# Altium project ApolloEcho_Dev_Kit.PrjPcb
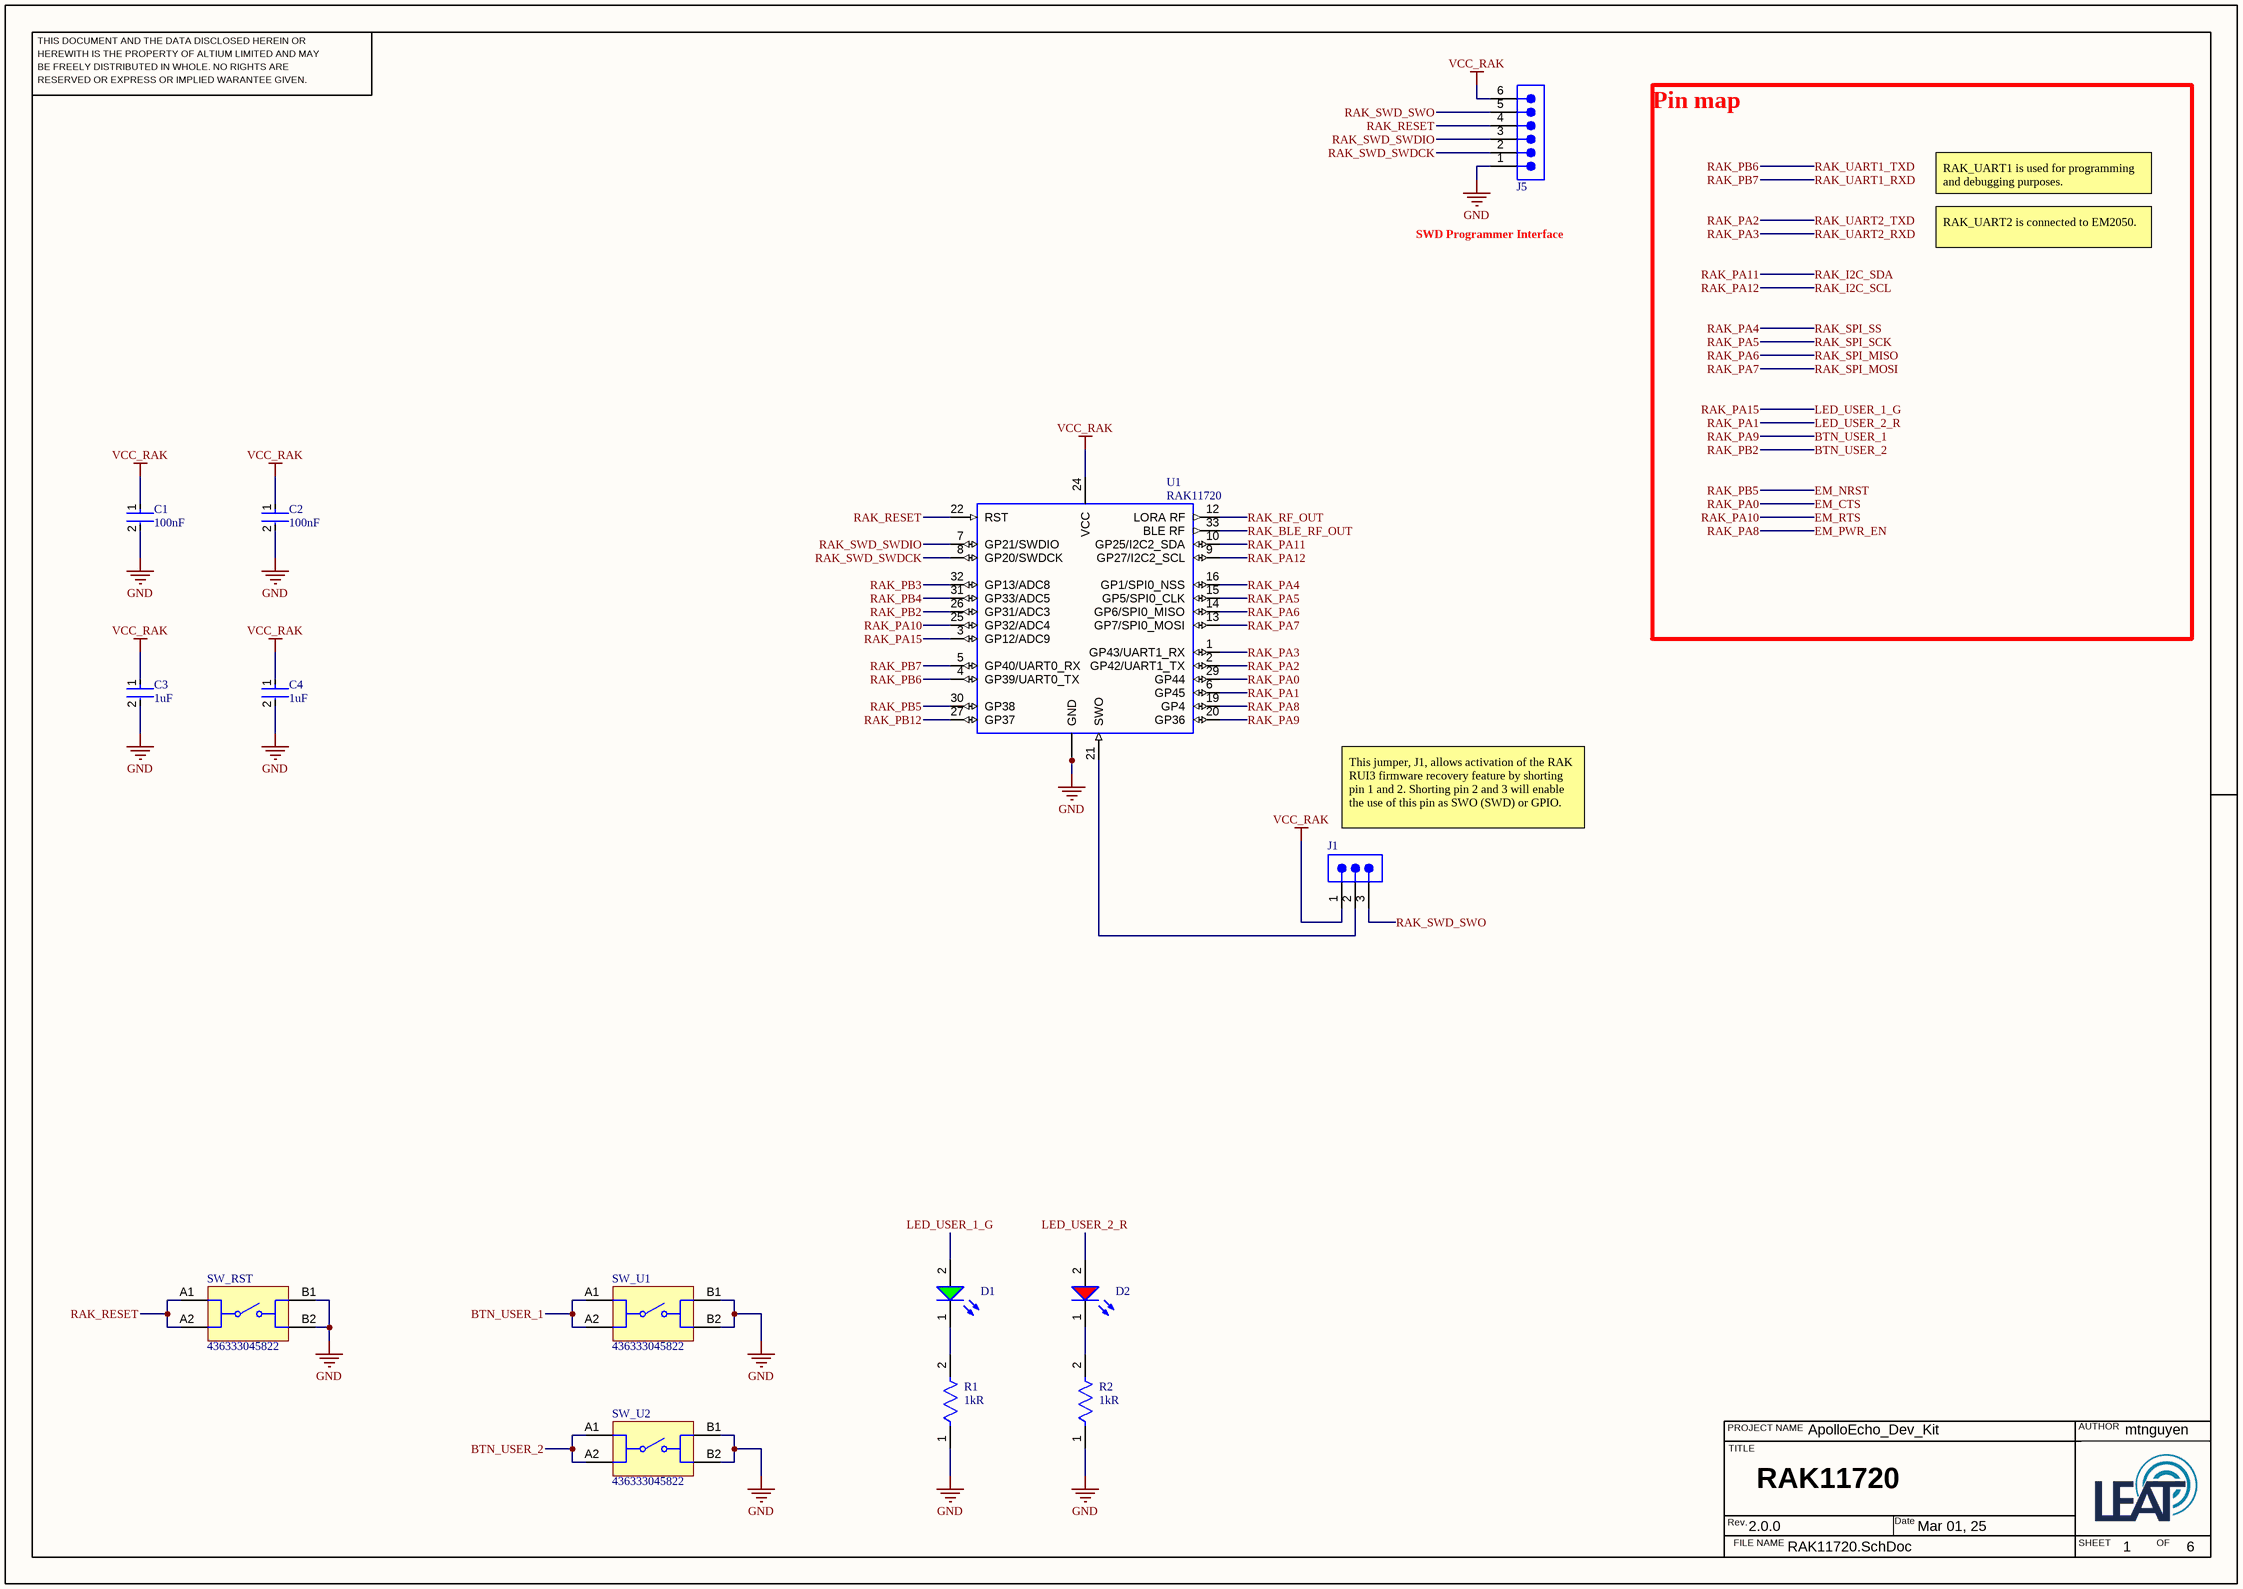
[diagram p0: RAK11720.SchDoc]
6 sheets, 74 parts. Net scope: global (net labels, ports and power ports of the same name join across sheets).
Board file: ApolloEcho_Dev_Kit.PcbDoc
Sheets:
  RAK11720.SchDoc
  EM2050.SchDoc
  USB_Serial.SchDoc
  Power.SchDoc
  RF.SchDoc
  IOs.SchDoc

## Sheet RAK11720.SchDoc
size 420 x 297 mm; ENG_APP_DATE: --/--/--; DSN_APP_DATE: --/--/--; CHK_APP_DATE: --/--/--; Date: TEST; SheetNumber: 1; SheetTotal: 6; Sheet_Text_ProjectName: ApolloEcho_Dev_Kit; Sheet_Text_Author: mtnguyen; Sheet_Text_Title: RAK11720; Sheet_Text_Rev: 2.0.0; Sheet_Text_Date: Mar 01, 25; SPICEModelCacheMDNMBSZG: <root> / <DocumentId>MDNMBSZG</DocumentId> / <CacheFrame Number="0"> / <Model Name="emk105bj105_v-f" Kind="CKT"> / <Text>* EMK105BJ105_V-F     SPICE MODEL  ( General Type ) / *-------------------------------------------------------------------------------------------------------- / * Model Generated by TAIYO YUDEN Corporation (http://www.ty-top.com) / * Version 1.0 / * TAIYO YUDEN Control No. 170508_130520 / * Copyright(c) 2012 TAIYO YUDEN CO.,LTD. All Rights Reserved. / *-------------------------------------------------------------------------------------------------------- / * / * Products Name : Multilayer Ceramic Capacitors / * / * Characteristics : / *     Capacitance : 1 uF , Rated Voltage : 16V , TCC : X5R / *     Case Size : 1.0 x 0.5 / 0.039 x 0.02 [mm/inch] , Thickness : 0.5 / 0.02 [mm/inch] / *     (Conditions: Temperature = 25 degC , DC Bias Current/Voltage = 0A / 0V) / * / * Frequency Range : 40Hz - 3GHz / * / * External Node Assignments : / * / *  1  o---| |---o  2 / * / *-------------------------------------------------------------------------------------------------------- / .SubCkt EMK105BJ105_V-F 1 2 / **************************** / C0 1 110 0.68309u / Cm 1 101 0.26053u / C1 101 102 0.94076u / Rc1 101 102 1.9029k / C2 102 103 0.66707u / Rc2 102 103 120.36 / C3 103 110 0.57203u / Rc3 103 110 2.1097 / C2m 1 301 0.1871u / C21 301 302 3.2494u / Rc21 301 302 1.1117k / C22 302 303 2.1014u / Rc22 302 303 1.484k / C23 303 304 2.1172u / Rc23 303 304 1.3876k / C24 304 305 0.75729u / Rc24 304 305 332.59 / C25 305 306 0.94401u / Rc25 305 306 249.09 / C26 306 307 0.34674u / Rc26 306 307 28.352 / C27 307 308 0.37158u / Rc27 307 308 19.989 / C28 308 309 0.17933u / Rc28 308 309 31.748 / C29 309 110 0.016445u / Rc29 309 110 1.0592 / Rp0 1 110 100Meg / L0 110 120 0.2216n / Lm 120 130 0.1509n / L1 120 121 0.12659n / RL1 121 130 0.85161 / L2 120 122 0.15996n / RL2 122 130 0.42469 / L3 120 123 7.9543n / RL3 123 130 0.54643m / CR 120 124 0.24334u / LR 124 125 0.090738n / RR 125 130 68.076m / CL 130 140 2.7354p / LL 130 140 0.10762n / RL 130 140 50.614 / Rs 140 2 7.5416m / **************************** / .ends EMK105BJ105_V-F</Text> / </Model> / </CacheFrame> / </root>

### Parts
C1  Capacitance: 100nF  [FP-0402-L_1_0_1-W_0_5_0_1-IPC_C]  (hidden comment: 0402ZD104KAT2A)
C2  Capacitance: 100nF  [FP-0402-L_1_0_1-W_0_5_0_1-IPC_C]  (hidden comment: 0402ZD104KAT2A)
C3  Capacitance: 1uF  [FP-0402-L_1_0_0_05-W_0_5-IPC_A]  (hidden comment: EMK105BJ105KV-F)
C4  Capacitance: 1uF  [FP-0402-L_1_0_0_05-W_0_5-IPC_A]  (hidden comment: EMK105BJ105KV-F)
D1  150060VS75000  [WL-SMCW_0603_150060xx75000]  (value not drawn)
D2  150060RS75000  [WL-SMCW_0603_150060xx75000]  (value not drawn)
J1  61300311121  [61300311121]  (value not drawn)
J5  61300611121  [61300611121]  (value not drawn)
R1  Resistance: 1kR  [FP-RMCF0402-IPC_A]  (hidden comment: RMCF0402FT1K00)
R2  Resistance: 1kR  [FP-RMCF0402-IPC_A]  (hidden comment: RMCF0402FT1K00)
SW_RST  436333045822  [436333045822]
SW_U1  436333045822  [436333045822]
SW_U2  436333045822  [436333045822]
U1  RAK11720  [RAK11720]

### Nets
GND: C1.2 C2.2 C3.2 C4.2 J5.1 R1.1 R2.1 SW_RST.B1 SW_RST.B2 SW_U1.B1 SW_U1.B2 SW_U2.B1 SW_U2.B2 U1.11(GND) U1.17(GND) U1.18(GND) U1.23(GND) U1.28(GND) U1.34(GND)
VCC_RAK: C1.1 C2.1 C3.1 C4.1 J1.1 J5.6 U1.24(VCC)
BTN_USER_1: SW_U1.A1 SW_U1.A2 U1.20(GP36)  [also labelled RAK_PA9]
BTN_USER_2: SW_U2.A1 SW_U2.A2 U1.26(GP31/ADC3)  [also labelled RAK_PB2]
EM_CTS: U1.29(GP44)  [also labelled RAK_PA0]
EM_NRST: U1.30(GP38)  [also labelled RAK_PB5]
EM_PWR_EN: U1.19(GP4)  [also labelled RAK_PA8]
EM_RTS: U1.25(GP32/ADC4)  [also labelled RAK_PA10]
LED_USER_1_G: D1.2(A) U1.3(GP12/ADC9)  [also labelled RAK_PA15]
LED_USER_2_R: D2.2(A) U1.6(GP45)  [also labelled RAK_PA1]
RAK_BLE_RF_OUT: U1.33(BLE_RF)
RAK_I2C_SCL: U1.9(GP27/I2C2_SCL)  [also labelled RAK_PA12]
RAK_I2C_SDA: U1.10(GP25/I2C2_SDA)  [also labelled RAK_PA11]
RAK_PA2: U1.2(GP42/UART1_TX)  [also labelled RAK_UART2_TXD]
RAK_PA3: U1.1(GP43/UART1_RX)  [also labelled RAK_UART2_RXD]
RAK_PA4: U1.16(GP1/SPI0_NSS)  [also labelled RAK_SPI_SS]
RAK_PA5: U1.15(GP5/SPI0_CLK)  [also labelled RAK_SPI_SCK]
RAK_PA6: U1.14(GP6/SPI0_MISO)  [also labelled RAK_SPI_MISO]
RAK_PA7: U1.13(GP7/SPI0_MOSI)  [also labelled RAK_SPI_MOSI]
RAK_PB3: U1.32(GP13/ADC8)
RAK_PB4: U1.31(GP33/ADC5)
RAK_PB6: U1.4(GP39/UART0_TX)  [also labelled RAK_UART1_TXD]
RAK_PB7: U1.5(GP40/UART0_RX)  [also labelled RAK_UART1_RXD]
RAK_PB12: U1.27(GP37)
RAK_RESET: J5.4 SW_RST.A1 SW_RST.A2 U1.22(RST)
RAK_RF_OUT: U1.12(LORA_RF)
RAK_SWD_SWDCK: J5.2 U1.8(GP20/SWDCK)
RAK_SWD_SWDIO: J5.3 U1.7(GP21/SWDIO)
RAK_SWD_SWO: J1.3 J5.5
NetD1_1: D1.1(K) R1.2
NetD2_1: D2.1(K) R2.2
NetJ1_2: J1.2 U1.21(SWO)

### Notes on the sheet
- RAK_UART1 is used for programming and debugging purposes.
- SWD Programmer Interface
- RAK_UART2 is connected to EM2050.
- Pin map
- This jumper, J1, allows activation of the RAK RUI3 firmware recovery feature by shorting pin 1 and 2. Shorting pin 2 and 3 will enable the use of this pin as SWO (SWD) or GPIO.
- THIS DOCUMENT AND THE DATA DISCLOSED HEREIN OR
- HEREWITH IS THE PROPERTY OF ALTIUM LIMITED AND MAY
- BE FREELY DISTRIBUTED IN WHOLE. NO RIGHTS ARE
- RESERVED OR EXPRESS OR IMPLIED WARANTEE GIVEN.
- PROJECT NAME
- TITLE
- AUTHOR
- Rev.
- FILE NAME
- Date
- SHEET
- OF

### Library data of the parts
C1 C2 = CMP-2008-02878-3: General Purpose Ceramic Capacitor, 0402, 100nF, 10%, X5R, 15%, 10V; Dissipation Factor: 5%; Insulation Resistance: 100GR; Case/Package: 0402; Termination: SMD/SMT; Thickness: 0.022inch; Packaging: Tape and Reel; REACH SVHC: No SVHC; Case Code (Imperial): 0402; Width: 0.02inch; Series: -; Construction: Flat; Dielectric: X5R; Voltage: 10V; Height: 0.56mm; Voltage Rating (DC): 10V; Depth: 0.5mm; Tolerance: 10%; Radiation Hardening: No; Voltage Rating: 10V; Package Quantity: 1; Contact Plating: Tin; RoHS Compliant: Yes; Case Code (Metric): 1005; Lead Free: Lead Free; Max Operating Temperature: 85°C; Length: 1mm; Min Operating Temperature: -55°C; Mount: Surface Mount
C3 C4 = CMP-14477-000104-2: None; Tolerance: 10%; Voltage Rating: 16V; Dielectric: X5R; Packaging: Tape and Reel; Depth: 0.5mm; Mount: Surface Mount; Thickness: 0.022inch; Package Quantity: 1; Min Operating Temperature: -55°C; Series: M; Voltage Rating (DC): 16V; Termination: SMD/SMT; Case/Package: 0402; Number of Pins: 2; Case Code (Imperial): 0402; Length: 1mm; Halogen Free: Halogen Free; Case Code (Metric): 1005; Width: 0.02inch; RoHS Compliant: Yes; Radiation Hardening: No; Max Operating Temperature: 85°C; Height: 0.5mm; Construction: Flat
D1 = CMP-1426-00006-7: WURTH ELEKTRONIK - 150060VS75000 - LED, Green, SMD, 0603, 30 mA, 2 V, 570 nm; Reverse Voltage: 5V; Power Dissipation: 72mW; Dominant Wavelength: 570nm; Peak Wavelength: 572nm; Forward Current: 100mA; Forward Voltage: 2V; Lens Style: Clear, Rectangular; Test Current: 20mA; Max Junction Temperature (Tj): 95°C; Viewing Angle: 140°; Luminous Intensity: 40mcd; Height: 700µm; Width: 800µm; Length: 1.6mm; Mount: Surface Mount; Min Operating Temperature: -40°C; Max Reverse Voltage (DC): 5V; Case Code (Imperial): 0603; Wavelength: 570nm; Color: Green; REACH SVHC: Unknown; RoHS: Compliant; Max Operating Temperature: 85°C; Packaging: Tape and Reel; Case/Package: 0603; Number of Pins: 2; Case Code (Metric): 1608
D2 = CMP-1426-00001-4: LED Low-Power Uni-Color Red 630nm 2V 2-Pin Chip 0603(1608Metric) T/R; Max Junction Temperature (Tj): 95°C; Dominant Wavelength: 625nm; Lens Style: Clear, Rectangular; Viewing Angle: 140°; Forward Current: 100mA; Max Reverse Voltage (DC): 5V; Luminous Intensity: 250mcd; Test Current: 20mA; Power Dissipation: 72mW; Max Operating Temperature: 85°C; Mount: Surface Mount; Height: 700µm; Packaging: Tape and Reel; REACH SVHC: Unknown; Case Code (Metric): 1608; Peak Wavelength: 630nm; Forward Voltage: 2V; Case/Package: 0603; Color: Red; RoHS: Compliant; Width: 800µm; Reverse Voltage: 5V; Min Operating Temperature: -40°C; Wavelength: 625nm; Case Code (Imperial): 0603; Length: 1.6mm
J1 = CMP-1502-01062-3: NexarPartId: 32855521; Current Rating: 3A; Voltage Rating: 250V; Number of Positions: 3; Pitch: 2.54mm; Contact Resistance: 20mΩ; Connector Type: Male Pin; Gender: Male; REACH SVHC: Unknown; Packaging: Bulk; Contact Material: Copper; Min Operating Temperature: -40°C; Number of Rows: 1; Orientation: Vertical; RoHS: Compliant; Contact Plating: Gold; Max Operating Temperature: 105°C; Mount: Through Hole; Height: 8.94mm; Operating Supply Voltage: 250V; Number of Pins: 3; Contact Mating Length: 5.9944mm; Number of Contacts: 3; Color: Black; Lead Free: Lead Free; Lead Pitch: 2.54mm; Termination: Solder
J5 = CMP-1502-01070-3: NexarPartId: 20084590; Current Rating: 3A; Pitch: 2.54mm; Gender: Male; Operating Supply Voltage: 250V; Connector Type: Male Pin; Number of Positions: 6; Contact Resistance: 20mΩ; Packaging: Bulk; Number of Pins: 6; Number of Rows: 1; Contact Plating: Gold; Lead Free: Lead Free; RoHS: Compliant; Contact Mating Length: 5.9944mm; Voltage Rating: 250V; REACH SVHC: Unknown; Contact Gender: Male; Housing Material: PBT; Min Operating Temperature: -40°C; Lead Pitch: 2.54mm; Mount: Through Hole; Number of Contacts: 6; Max Operating Temperature: 105°C; Contact Material: Copper; Orientation: Vertical; Termination: Through Hole; Color: Black; Height: 8.89mm
R1 R2 = CMP-26527-000026-1: 1kΩ ±1% 0.063W 0402 Thick Film Chip Resistor AEC-Q200 compliant; Temperature Coefficient: 100ppm/°C; Power Rating: 63mW; Length: 1mm; RoHS Compliant: Yes; Construction: Rectangular; Height: 0.016inch; Size Code: 0402; Lead Free: Lead Free; Radiation Hardening: No; Tolerance: 1%; Width: 0.02inch; Military Standard: Not; Resistor Type: Thick Film; Number of Terminations: 2; Min Operating Temperature: -55°C; Max Operating Temperature: 155°C; Depth: 0.5mm; Features: Automotive AEC-Q200; Packaging: Tape and Reel; Case Code (Metric): 1005; Mount: Surface Mount; Contact Plating: Tin; Max Power Dissipation: 63mW; Case/Package: 0402; Case Code (Imperial): 0402; Series: RMCF
SW_RST SW_U1 SW_U2 = CMP-1464-00001-2: NexarPartId: 22866045; Voltage Rating: 12V; Contact Resistance: 100mΩ; Operating Force: 220N; Current Rating: 50mA; Height: 1.65mm; Contact Plating: Silver; Min Operating Temperature: -40°C; Insulation Resistance: 100MΩ; Max Operating Temperature: 85°C; RoHS: Compliant; Packaging: Tape and Reel; Width: 4.7mm; Contact Current Rating: 50mA
U1 = RAK11720: RAK11720 Ambiq Apollo3 Blue SX1262 LoRa Bluetooth Module for LoRaWAN; MP: RAK3172; MF: Shenzhen RAKwireless Technology Co.,Ltd.; Value: *; Check_prices: https://www.snapeda.com/parts/RAK3172/Shenzhen+RAKwireless+Technology+Co.%252CLtd./view-part/?ref=eda; Package: Package; Price: None; Availability: Not in stock; SnapEDA_Link: https://www.snapeda.com/parts/RAK3172/Shenzhen+RAKwireless+Technology+Co.%252CLtd./view-part/?ref=snap

## Sheet EM2050.SchDoc
size 420 x 297 mm; ENG_APP_DATE: --/--/--; DSN_APP_DATE: --/--/--; CHK_APP_DATE: --/--/--; Date: TEST; SheetNumber: 2; SheetTotal: 6; Sheet_Text_ProjectName: ApolloEcho_Dev_Kit; Sheet_Text_Author: mtnguyen; Sheet_Text_Title: EM2050; Sheet_Text_Rev: 2.0.0; Sheet_Text_Date: Mar 01, 25; SPICEModelCacheUWNOKGRN: <root> / <DocumentId>UWNOKGRN</DocumentId> / <CacheFrame Number="0"> / <Model Name="emk105bj105_v-f" Kind="CKT"> / <Text>* EMK105BJ105_V-F     SPICE MODEL  ( General Type ) / *-------------------------------------------------------------------------------------------------------- / * Model Generated by TAIYO YUDEN Corporation (http://www.ty-top.com) / * Version 1.0 / * TAIYO YUDEN Control No. 170508_130520 / * Copyright(c) 2012 TAIYO YUDEN CO.,LTD. All Rights Reserved. / *-------------------------------------------------------------------------------------------------------- / * / * Products Name : Multilayer Ceramic Capacitors / * / * Characteristics : / *     Capacitance : 1 uF , Rated Voltage : 16V , TCC : X5R / *     Case Size : 1.0 x 0.5 / 0.039 x 0.02 [mm/inch] , Thickness : 0.5 / 0.02 [mm/inch] / *     (Conditions: Temperature = 25 degC , DC Bias Current/Voltage = 0A / 0V) / * / * Frequency Range : 40Hz - 3GHz / * / * External Node Assignments : / * / *  1  o---| |---o  2 / * / *-------------------------------------------------------------------------------------------------------- / .SubCkt EMK105BJ105_V-F 1 2 / **************************** / C0 1 110 0.68309u / Cm 1 101 0.26053u / C1 101 102 0.94076u / Rc1 101 102 1.9029k / C2 102 103 0.66707u / Rc2 102 103 120.36 / C3 103 110 0.57203u / Rc3 103 110 2.1097 / C2m 1 301 0.1871u / C21 301 302 3.2494u / Rc21 301 302 1.1117k / C22 302 303 2.1014u / Rc22 302 303 1.484k / C23 303 304 2.1172u / Rc23 303 304 1.3876k / C24 304 305 0.75729u / Rc24 304 305 332.59 / C25 305 306 0.94401u / Rc25 305 306 249.09 / C26 306 307 0.34674u / Rc26 306 307 28.352 / C27 307 308 0.37158u / Rc27 307 308 19.989 / C28 308 309 0.17933u / Rc28 308 309 31.748 / C29 309 110 0.016445u / Rc29 309 110 1.0592 / Rp0 1 110 100Meg / L0 110 120 0.2216n / Lm 120 130 0.1509n / L1 120 121 0.12659n / RL1 121 130 0.85161 / L2 120 122 0.15996n / RL2 122 130 0.42469 / L3 120 123 7.9543n / RL3 123 130 0.54643m / CR 120 124 0.24334u / LR 124 125 0.090738n / RR 125 130 68.076m / CL 130 140 2.7354p / LL 130 140 0.10762n / RL 130 140 50.614 / Rs 140 2 7.5416m / **************************** / .ends EMK105BJ105_V-F</Text> / </Model> / </CacheFrame> / </root>
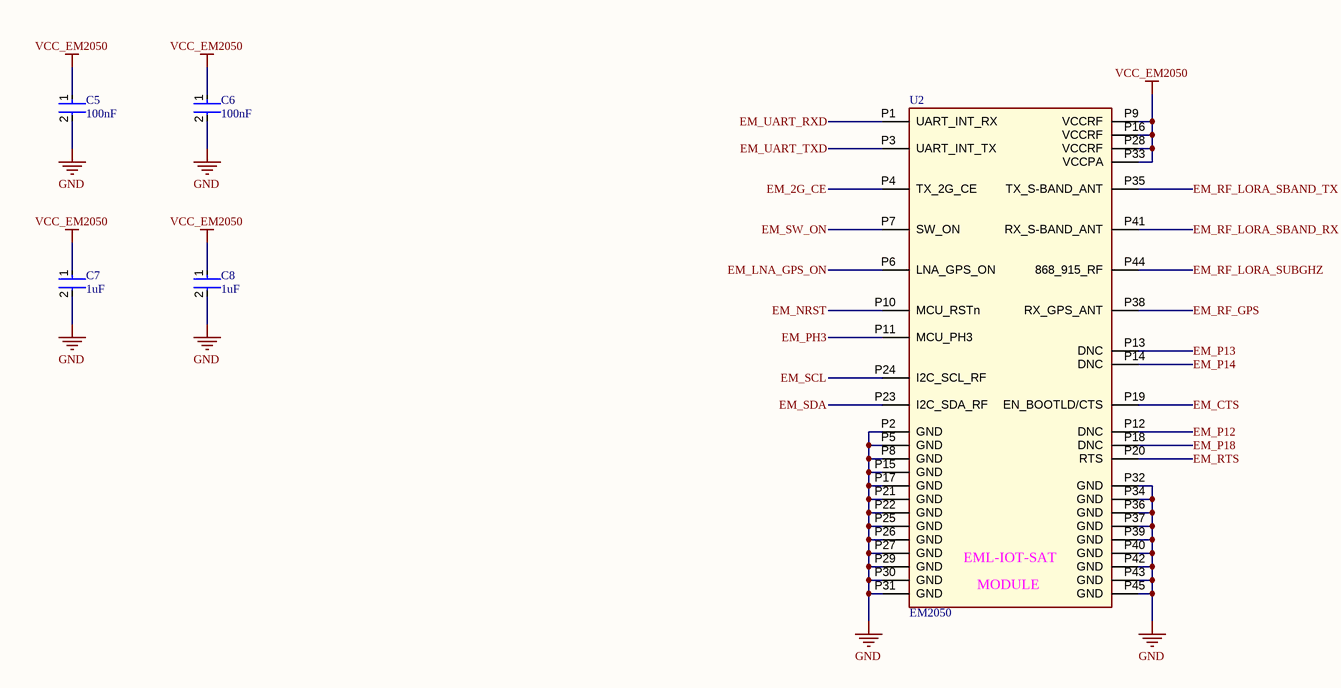
[diagram p1: EM2050.SchDoc]

### Parts
C5  Capacitance: 100nF  [FP-0402-L_1_0_1-W_0_5_0_1-IPC_C]  (hidden comment: 0402ZD104KAT2A)
C6  Capacitance: 100nF  [FP-0402-L_1_0_1-W_0_5_0_1-IPC_C]  (hidden comment: 0402ZD104KAT2A)
C7  Capacitance: 1uF  [FP-0402-L_1_0_0_05-W_0_5-IPC_A]  (hidden comment: EMK105BJ105KV-F)
C8  Capacitance: 1uF  [FP-0402-L_1_0_0_05-W_0_5-IPC_A]  (hidden comment: EMK105BJ105KV-F)
U2  value EM2050  [EM2050]  (hidden comment: IOT SAT module)

### Nets
GND: C5.2 C6.2 C7.2 C8.2 U2.P2(GND) U2.P5(GND) U2.P8(GND) U2.P15(GND) U2.P17(GND) U2.P21(GND) U2.P22(GND) U2.P25(GND) U2.P26(GND) U2.P27(GND) U2.P29(GND) U2.P30(GND) U2.P31(GND) U2.P32(GND) U2.P34(GND) U2.P36(GND) U2.P37(GND) U2.P39(GND) U2.P40(GND) U2.P42(GND) U2.P43(GND) U2.P45(GND)
VCC_EM2050: C5.1 C6.1 C7.1 C8.1 U2.P9(VCCRF) U2.P16(VCCRF) U2.P28(VCCRF) U2.P33(VCCPA)
EM_2G_CE: U2.P4(TX_2G_CE)
EM_CTS: U2.P19(EN_BOOTLD/CTS)
EM_LNA_GPS_ON: U2.P6(LNA_GPS_ON)
EM_NRST: U2.P10(MCU_RSTn)
EM_P12: U2.P12(DNC)
EM_P13: U2.P13(DNC)
EM_P14: U2.P14(DNC)
EM_P18: U2.P18(DNC)
EM_PH3: U2.P11(MCU_PH3)
EM_RF_GPS: U2.P38(RX_GPS_ANT)
EM_RF_LORA_SBAND_RX: U2.P41(RX_S-BAND_ANT)
EM_RF_LORA_SBAND_TX: U2.P35(TX_S-BAND_ANT)
EM_RF_LORA_SUBGHZ: U2.P44(868_915_RF)
EM_RTS: U2.P20(RTS)
EM_SCL: U2.P24(I2C_SCL_RF)
EM_SDA: U2.P23(I2C_SDA_RF)
EM_SW_ON: U2.P7(SW_ON)
EM_UART_RXD: U2.P1(UART_INT_RX)
EM_UART_TXD: U2.P3(UART_INT_TX)

### Notes on the sheet
- THIS DOCUMENT AND THE DATA DISCLOSED HEREIN OR
- HEREWITH IS THE PROPERTY OF ALTIUM LIMITED AND MAY
- BE FREELY DISTRIBUTED IN WHOLE. NO RIGHTS ARE
- RESERVED OR EXPRESS OR IMPLIED WARANTEE GIVEN.
- PROJECT NAME
- TITLE
- AUTHOR
- Rev.
- FILE NAME
- Date
- SHEET
- OF
- (in symbol EM2050) EML-IOT-SAT; MODULE

### Library data of the parts
C5 C6 = CMP-2008-02878-3: as C1 on sheet RAK11720; Case/Package: 0402; Termination: SMD/SMT; Thickness: 0.022inch; Packaging: Tape and Reel; REACH SVHC: No SVHC; Case Code (Imperial): 0402; Width: 0.02inch; Series: -; Construction: Flat; Dielectric: X5R; Voltage: 10V; Height: 0.56mm; Voltage Rating (DC): 10V; Depth: 0.5mm; Tolerance: 10%; Radiation Hardening: No; Voltage Rating: 10V; Package Quantity: 1; Contact Plating: Tin; RoHS Compliant: Yes; Case Code (Metric): 1005; Lead Free: Lead Free; Max Operating Temperature: 85°C; Length: 1mm; Min Operating Temperature: -55°C; Mount: Surface Mount
C7 C8 = CMP-14477-000104-2: as C3 on sheet RAK11720; Packaging: Tape and Reel; Depth: 0.5mm; Mount: Surface Mount; Thickness: 0.022inch; Package Quantity: 1; Min Operating Temperature: -55°C; Series: M; Voltage Rating (DC): 16V; Termination: SMD/SMT; Case/Package: 0402; Number of Pins: 2; Case Code (Imperial): 0402; Length: 1mm; Halogen Free: Halogen Free; Case Code (Metric): 1005; Width: 0.02inch; RoHS Compliant: Yes; Radiation Hardening: No; Max Operating Temperature: 85°C; Height: 0.5mm; Construction: Flat
U2 = EM2050: Echostar Mobile IOT SAT Module - Basic version; Manufacturer: Echostar Mobile Ltd; Release: 1.0; VCCRF: 3.3V; Package: Module SMD 47x32mm; Manufacturer P/N: EM2050; Release date: 01/08/2022; RoHS Compliant: Yes; MSL: 3; VCCPA: 3.3V

## Sheet USB_Serial.SchDoc
size 420 x 297 mm; Organization: ORGANIZATION; Address1: ADDRESS 1; Address2: ADDRESS 2; Address3: ADDRESS 3; Address4: ADDRESS 4; Revision: -; SheetNumber: 3; SheetTotal: 6; ENG_APP_DATE: --/--/--; DSN_APP_DATE: --/--/--; CHK_APP_DATE: --/--/--; Sheet_Text_ProjectName: ApolloEcho_Dev_Kit; Sheet_Text_Author: mtnguyen; Sheet_Text_Title: USB_Serial; Sheet_Text_Rev: 2.0.0; Sheet_Text_Date: Mar 01, 25
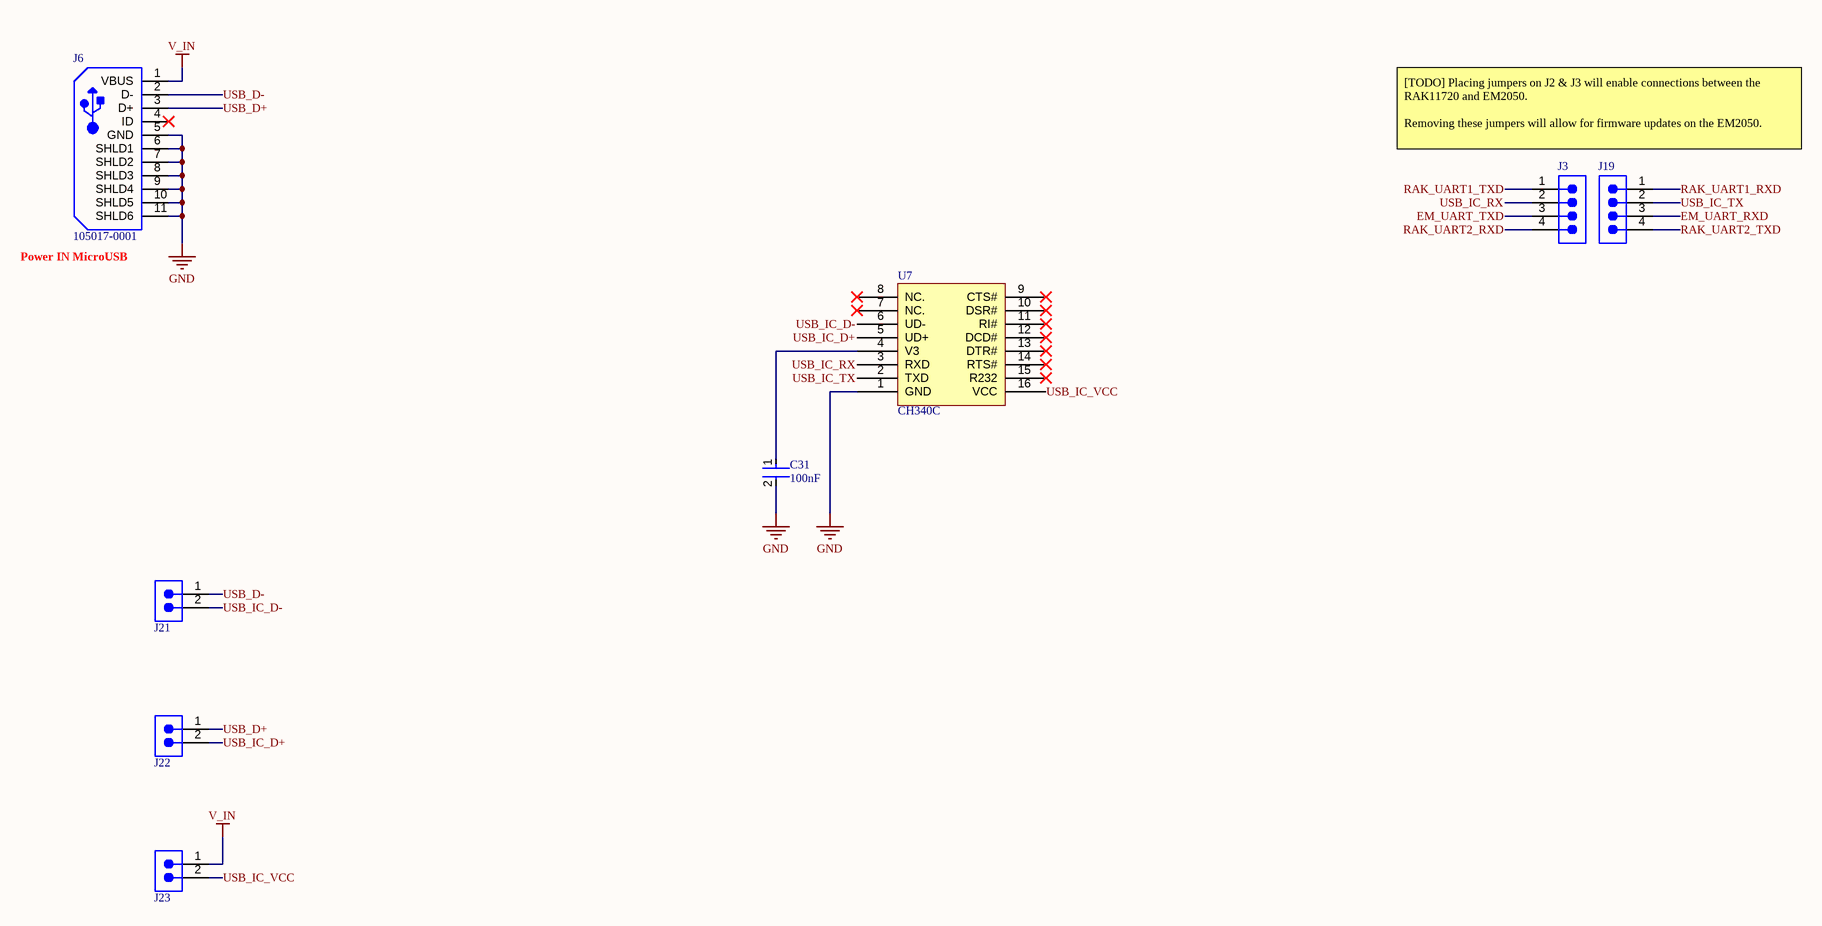
[diagram p2: USB_Serial.SchDoc]

### Parts
C31  Capacitance: 100nF  [FP-0402-L_1_0_1-W_0_5_0_1-IPC_C]  (hidden comment: 0402ZD104KAT2A)
J3  61300411121  [61300411121]  (value not drawn)
J6  105017-0001  [USB-MICRO-B_V]
J19  61300411121  [61300411121]  (value not drawn)
J21  61300211121  [61300211121]  (value not drawn)
J22  61300211121  [61300211121]  (value not drawn)
J23  61300211121  [61300211121]  (value not drawn)
U7  CH340C  [CH340C]

### Nets
GND: C31.2 J6.5(GND) J6.6(SHLD1) J6.7(SHLD2) J6.8(SHLD3) J6.9(SHLD4) J6.10(SHLD5) J6.11(SHLD6) U7.1(GND)
V_IN: J6.1(VBUS) J23.1
EM_UART_RXD: J19.3
EM_UART_TXD: J3.3
RAK_UART1_RXD: J19.1  [project net RAK_PB7]
RAK_UART1_TXD: J3.1  [project net RAK_PB6]
RAK_UART2_RXD: J3.4  [project net RAK_PA3]
RAK_UART2_TXD: J19.4  [project net RAK_PA2]
USB_D+: J6.3(D+) J22.1
USB_D-: J6.2(D-) J21.1
USB_IC_D+: J22.2 U7.5(UD+)
USB_IC_D-: J21.2 U7.6(UD-)
USB_IC_RX: J3.2 U7.3(RXD)
USB_IC_TX: J19.2 U7.2(TXD)
USB_IC_VCC: J23.2 U7.16(VCC)
NetC31_1: C31.1 U7.4(V3)

Not connected (* = marked no-connect by the designer): J6 4(ID)*; U7 7(NC.)* 8(NC.)* 9(CTS#)* 10(DSR#)* 11(RI#)* 12(DCD#)* 13(DTR#)* 14(RTS#)* 15(R232)*

### Notes on the sheet
- [TODO] Placing jumpers on J2 & J3 will enable connections between the RAK11720 and EM2050.
  Removing these jumpers will allow for firmware updates on the EM2050.
- (near J6) Power IN MicroUSB
- THIS DOCUMENT AND THE DATA DISCLOSED HEREIN OR
- HEREWITH IS THE PROPERTY OF ALTIUM LIMITED AND MAY
- BE FREELY DISTRIBUTED IN WHOLE. NO RIGHTS ARE
- RESERVED OR EXPRESS OR IMPLIED WARANTEE GIVEN.
- PROJECT NAME
- TITLE
- AUTHOR
- Rev.
- FILE NAME
- Date
- SHEET
- OF

### Library data of the parts
C31 = CMP-2008-02878-3: as C1 on sheet RAK11720; Case/Package: 0402; Termination: SMD/SMT; Thickness: 0.022inch; Packaging: Tape and Reel; REACH SVHC: No SVHC; Case Code (Imperial): 0402; Width: 0.02inch; Series: -; Construction: Flat; Dielectric: X5R; Voltage: 10V; Height: 0.56mm; Voltage Rating (DC): 10V; Depth: 0.5mm; Tolerance: 10%; Radiation Hardening: No; Voltage Rating: 10V; Package Quantity: 1; Contact Plating: Tin; RoHS Compliant: Yes; Case Code (Metric): 1005; Lead Free: Lead Free; Max Operating Temperature: 85°C; Length: 1mm; Min Operating Temperature: -55°C; Mount: Surface Mount
J3 J19 = CMP-1502-01064-3: NexarPartId: 32855522; Operating Supply Voltage: 250V; Pitch: 2.54mm; Contact Resistance: 20mΩ; Number of Positions: 4; Current Rating: 3A; Connector Type: Male Pin; Gender: Male; Contact Plating: Gold; Height: 8.89mm; Lead Pitch: 2.54mm; Lead Free: Lead Free; Contact Mating Length: 5.9944mm; Number of Rows: 1; Termination: Solder; Packaging: Bulk; REACH SVHC: Unknown; Min Operating Temperature: -40°C; RoHS: Compliant; Number of Contacts: 4; Voltage Rating: 250V; Color: Black; Max Operating Temperature: 105°C; Contact Material: Copper; Mount: Through Hole; Orientation: Vertical; Number of Pins: 4
J6 = CMP-2000-05827-1: Micro-USB B Receptacle, Right Angle, Bottom Mount, Surface Mount, with Solder Tabs, -30 to 85 degC, 5-Pin USB, RoHS, Tape and Reel; Manufacturer: Molex; Featured Product: Micro-USBConnectorsUSBConnectors; Other Names: WM1399DKR; Package Version: Rev. F, 12/2012; Number of Contacts: 5; Connector Type: USB-microB; Catalog Drawings: 1050170001; 3D Model: 105017-0001.stp; Mating Products: WM17145-ND-CABLEMICROUSBBTOSTDA1.0MWM17147-ND-CABLEMICROUSBBTOSTDA2.0MWM17146-ND-CABLEMICROUSBBTOSTDA1.5M; PCN Assembly/Origin: ResinSupplier21/Oct/2015; Voltage - Max: 30V; Online Catalog: Molex-MicroUSB; Manufacturer URL: http://www.molex.com/; Package Description: 5-Leads USB, Micro B, Body 7.5 x 5 mm, Pitch 0.65 mm; Datasheet URL: http://www.molex.com/elqNow/elqRedir.htm?ref=http://www.molex.com/webdocs/datasheets/pdf/en-us/1050170001_IO_CONNECTORS.pdf; Ingress Protection: -; Datasheet Version: 03/2016; Mounting Type: BoardCutout,SurfaceMount,RightAngle; Circuits: 5; Standard Package: 1; Package Reference: MICRO-B; Package URL: http://www.molex.com/pdm_docs/sd/1050170001_sd.pdf; Category: Connectors,Interconnects; Series: -; RoHS Information: 1050170001CertofCompliance; Features: Shielded,SolderRetention; Family: USB,DVI,HDMIConnectors; Specifications: -; Gender: Receptacle; Packaging: Digi-Reel®; Mounting Technology: SurfaceMount
J21-J23 = CMP-1712-00002-6: NexarPartId: 20081794; Number of Contacts: 2; Pitch: 2.54mm; Connector Type: Male Pin; Voltage Rating: 250V; Current Rating: 3A; Gender: Male; Contact Resistance: 20mΩ; Height: 8.94mm; Lead Free: Lead Free; Number of Pins: 2; Termination: Through Hole; RoHS: Compliant; Lead Pitch: 2.54mm; REACH SVHC: No SVHC; Housing Material: PBT; Contact Mating Length: 5.9944mm; Min Operating Temperature: -40°C; Orientation: Vertical; Contact Material: Copper; Contact Gender: Male; Max Operating Temperature: 125°C; Number of Rows: 1; Number of Positions: 2; Packaging: Bulk; Contact Plating: Gold; Mount: Through Hole; Color: Black; Operating Supply Voltage: 250V
U7 = CH340C: USB to Serial CH340 IC

## Sheet Power.SchDoc
size 420 x 297 mm; ENG_APP_DATE: --/--/--; DSN_APP_DATE: --/--/--; CHK_APP_DATE: --/--/--; Date: TEST; SheetNumber: 4; SheetTotal: 6; Sheet_Text_ProjectName: ApolloEcho_Dev_Kit; Sheet_Text_Author: mtnguyen; Sheet_Text_Title: Power; Sheet_Text_Rev: 2.0.0; Sheet_Text_Date: Mar 01, 25; SPICEModelCacheVANAQJKB: <root> / <DocumentId>VANAQJKB</DocumentId> / <CacheFrame Number="0"> / <Model Name="emk105bj105_v-f" Kind="CKT"> / <Text>* EMK105BJ105_V-F     SPICE MODEL  ( General Type ) / *-------------------------------------------------------------------------------------------------------- / * Model Generated by TAIYO YUDEN Corporation (http://www.ty-top.com) / * Version 1.0 / * TAIYO YUDEN Control No. 170508_130520 / * Copyright(c) 2012 TAIYO YUDEN CO.,LTD. All Rights Reserved. / *-------------------------------------------------------------------------------------------------------- / * / * Products Name : Multilayer Ceramic Capacitors / * / * Characteristics : / *     Capacitance : 1 uF , Rated Voltage : 16V , TCC : X5R / *     Case Size : 1.0 x 0.5 / 0.039 x 0.02 [mm/inch] , Thickness : 0.5 / 0.02 [mm/inch] / *     (Conditions: Temperature = 25 degC , DC Bias Current/Voltage = 0A / 0V) / * / * Frequency Range : 40Hz - 3GHz / * / * External Node Assignments : / * / *  1  o---| |---o  2 / * / *-------------------------------------------------------------------------------------------------------- / .SubCkt EMK105BJ105_V-F 1 2 / **************************** / C0 1 110 0.68309u / Cm 1 101 0.26053u / C1 101 102 0.94076u / Rc1 101 102 1.9029k / C2 102 103 0.66707u / Rc2 102 103 120.36 / C3 103 110 0.57203u / Rc3 103 110 2.1097 / C2m 1 301 0.1871u / C21 301 302 3.2494u / Rc21 301 302 1.1117k / C22 302 303 2.1014u / Rc22 302 303 1.484k / C23 303 304 2.1172u / Rc23 303 304 1.3876k / C24 304 305 0.75729u / Rc24 304 305 332.59 / C25 305 306 0.94401u / Rc25 305 306 249.09 / C26 306 307 0.34674u / Rc26 306 307 28.352 / C27 307 308 0.37158u / Rc27 307 308 19.989 / C28 308 309 0.17933u / Rc28 308 309 31.748 / C29 309 110 0.016445u / Rc29 309 110 1.0592 / Rp0 1 110 100Meg / L0 110 120 0.2216n / Lm 120 130 0.1509n / L1 120 121 0.12659n / RL1 121 130 0.85161 / L2 120 122 0.15996n / RL2 122 130 0.42469 / L3 120 123 7.9543n / RL3 123 130 0.54643m / CR 120 124 0.24334u / LR 124 125 0.090738n / RR 125 130 68.076m / CL 130 140 2.7354p / LL 130 140 0.10762n / RL 130 140 50.614 / Rs 140 2 7.5416m / **************************** / .ends EMK105BJ105_V-F</Text> / </Model> / </CacheFrame> / </root>
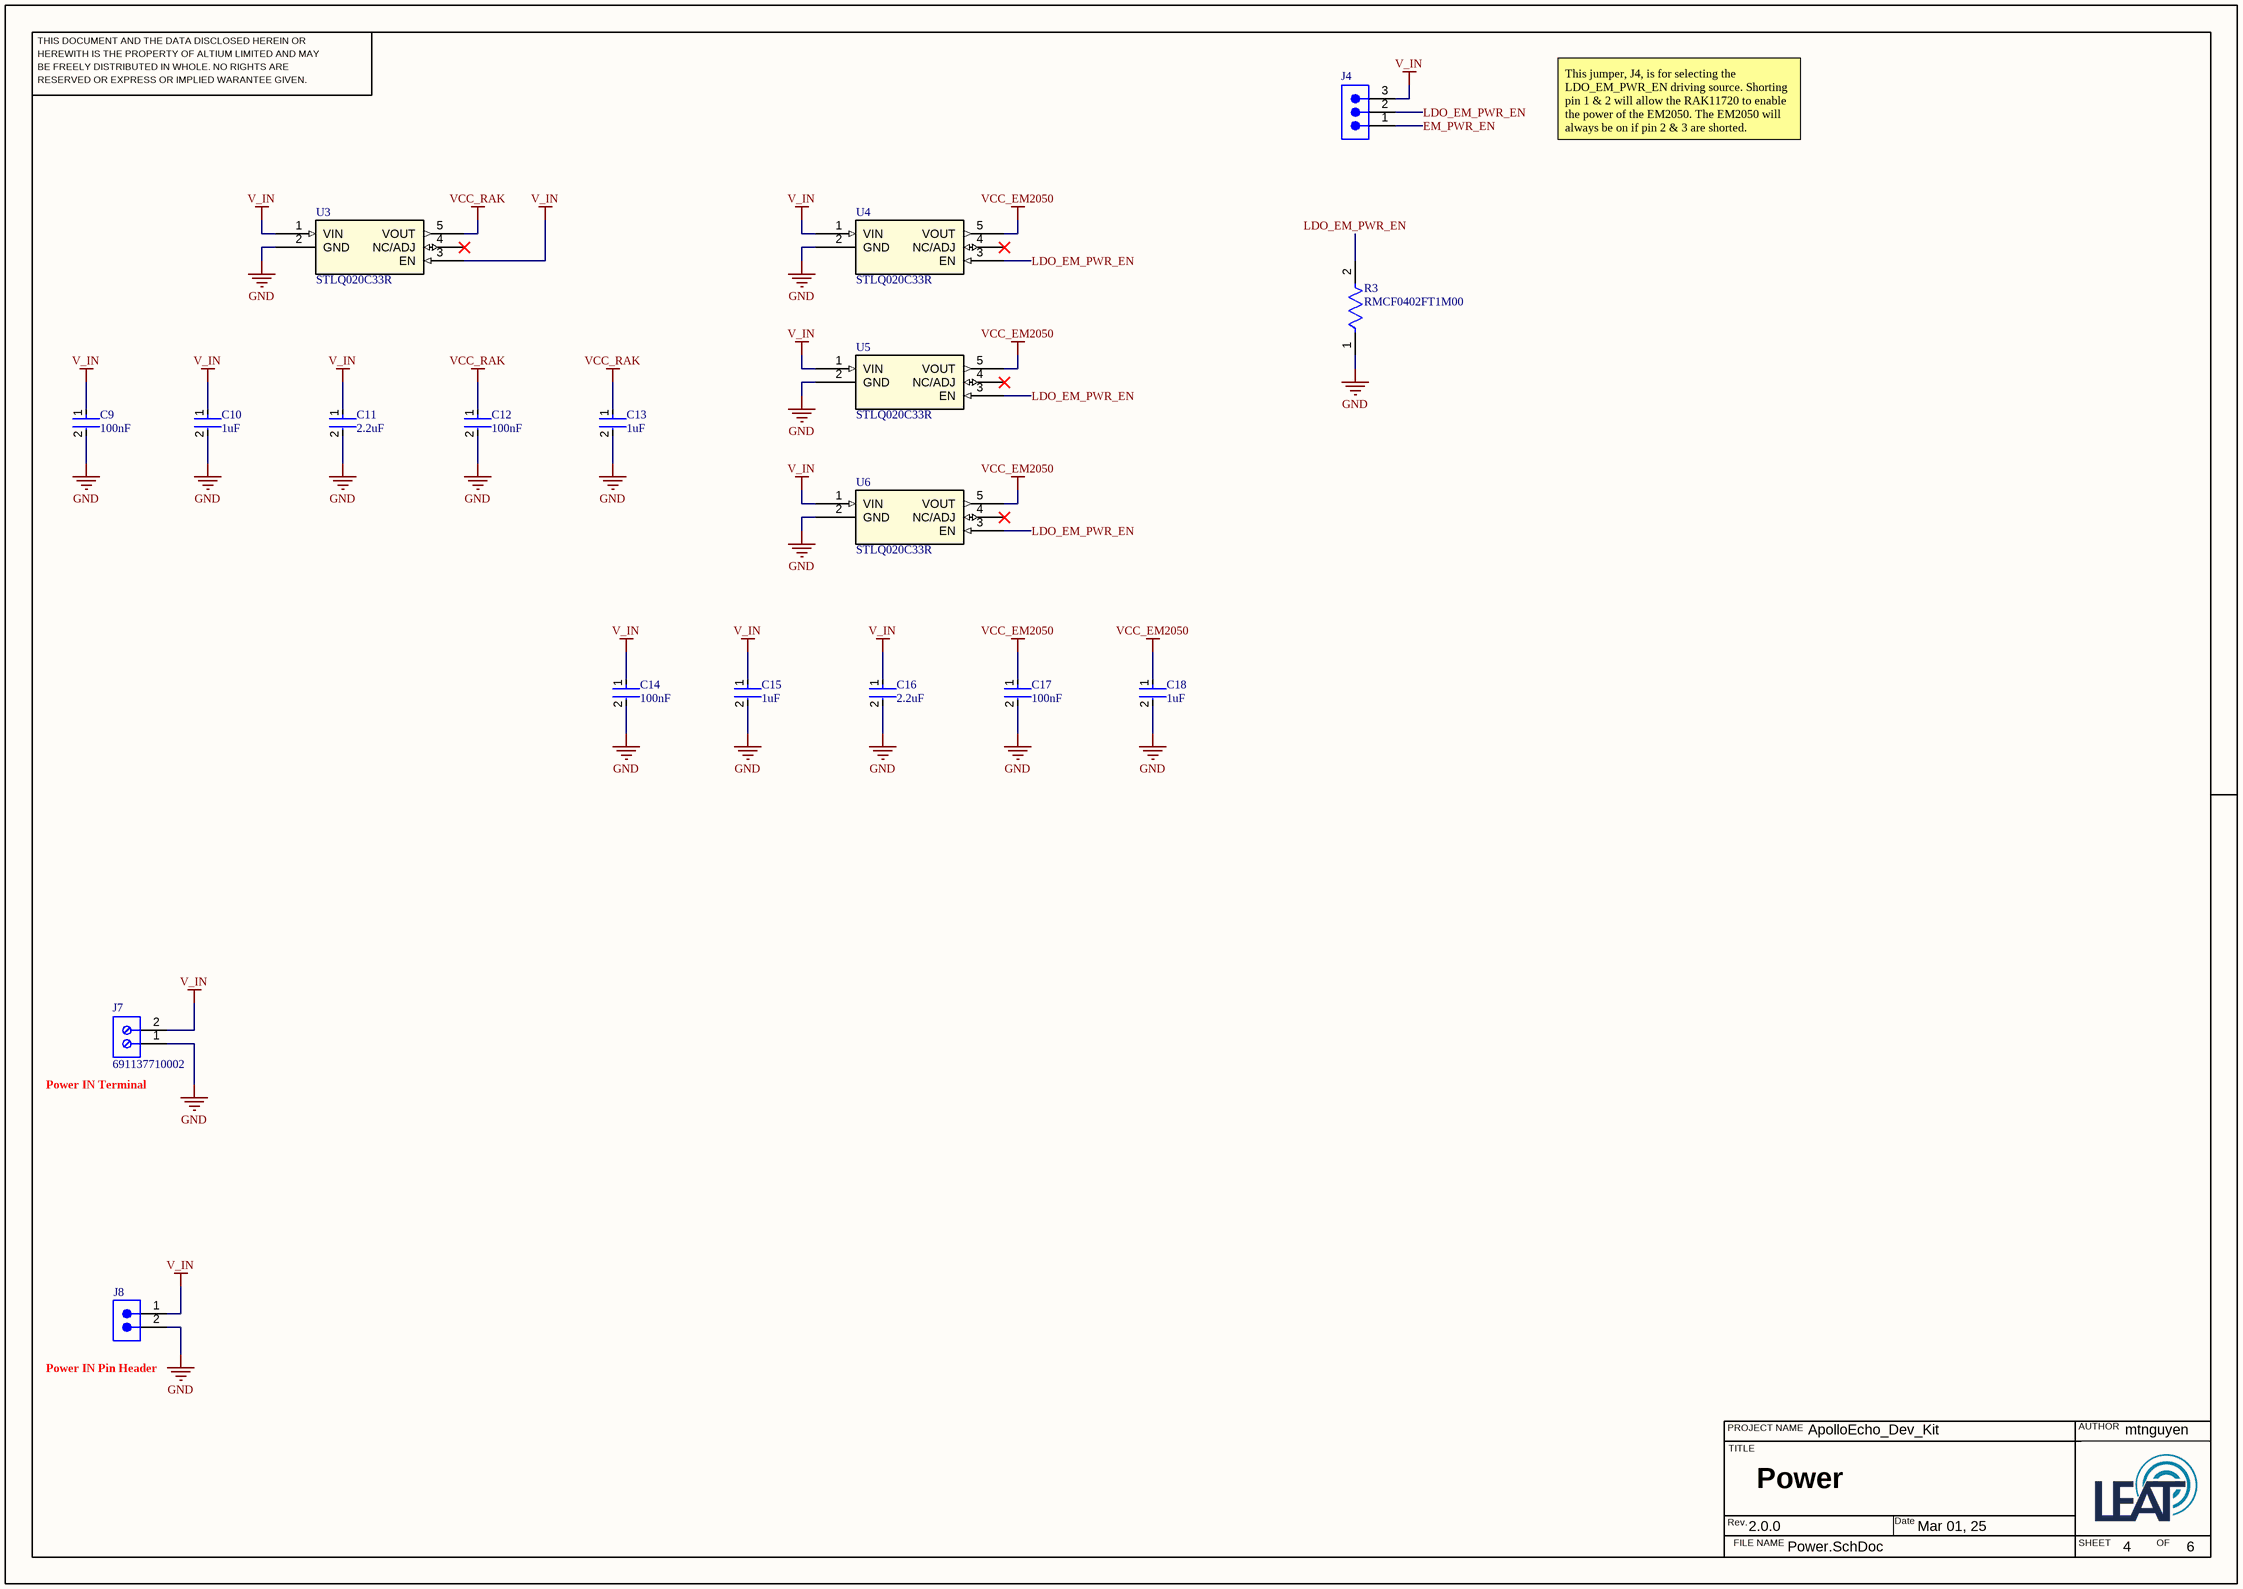
[diagram p3: Power.SchDoc]

### Parts
C9  Capacitance: 100nF  [FP-0402-L_1_0_1-W_0_5_0_1-IPC_C]  (hidden comment: 0402ZD104KAT2A)
C10  Capacitance: 1uF  [FP-0402-L_1_0_0_05-W_0_5-IPC_A]  (hidden comment: EMK105BJ105KV-F)
C11  Capacitance: 2.2uF  [FP-C1005-050-0_05-IPC_A]  (hidden comment: C1005X5R1A225K050BC)
C12  Capacitance: 100nF  [FP-0402-L_1_0_1-W_0_5_0_1-IPC_C]  (hidden comment: 0402ZD104KAT2A)
C13  Capacitance: 1uF  [FP-0402-L_1_0_0_05-W_0_5-IPC_A]  (hidden comment: EMK105BJ105KV-F)
C14  Capacitance: 100nF  [FP-0402-L_1_0_1-W_0_5_0_1-IPC_C]  (hidden comment: 0402ZD104KAT2A)
C15  Capacitance: 1uF  [FP-0402-L_1_0_0_05-W_0_5-IPC_A]  (hidden comment: EMK105BJ105KV-F)
C16  Capacitance: 2.2uF  [FP-C1005-050-0_05-IPC_A]  (hidden comment: C1005X5R1A225K050BC)
C17  Capacitance: 100nF  [FP-0402-L_1_0_1-W_0_5_0_1-IPC_C]  (hidden comment: 0402ZD104KAT2A)
C18  Capacitance: 1uF  [FP-0402-L_1_0_0_05-W_0_5-IPC_A]  (hidden comment: EMK105BJ105KV-F)
J4  61300311121  [61300311121]  (value not drawn)
J7  691137710002  [691137710002]
J8  61300211121  [61300211121]  (value not drawn)
R3  RMCF0402FT1M00  [FP-RMCF0402-MFG]
U3  STLQ020C33R  [SOT323-5L_STM]
U4  STLQ020C33R  [SOT323-5L_STM]
U5  STLQ020C33R  [SOT323-5L_STM]
U6  STLQ020C33R  [SOT323-5L_STM]

### Nets
GND: C9.2 C10.2 C11.2 C12.2 C13.2 C14.2 C15.2 C16.2 C17.2 C18.2 J7.1 J8.2 R3.1 U3.2(GND) U4.2(GND) U5.2(GND) U6.2(GND)
V_IN: C9.1 C10.1 C11.1 C14.1 C15.1 C16.1 J4.3 J7.2 J8.1 U3.1(VIN) U3.3(EN) U4.1(VIN) U5.1(VIN) U6.1(VIN)
VCC_EM2050: C17.1 C18.1 U4.5(VOUT) U5.5(VOUT) U6.5(VOUT)
VCC_RAK: C12.1 C13.1 U3.5(VOUT)
EM_PWR_EN: J4.1
LDO_EM_PWR_EN: J4.2 R3.2 U4.3(EN) U5.3(EN) U6.3(EN)

Not connected (* = marked no-connect by the designer): U3 4(NC/ADJ)*; U4 4(NC/ADJ)*; U5 4(NC/ADJ)*; U6 4(NC/ADJ)*

### Notes on the sheet
- This jumper, J4, is for selecting the LDO_EM_PWR_EN driving source. Shorting pin 1 & 2 will allow the RAK11720 to enable the power of the EM2050. The EM2050 will always be on if pin 2 & 3 are shorted.
- (near J7) Power IN Terminal
- (near J8) Power IN Pin Header
- THIS DOCUMENT AND THE DATA DISCLOSED HEREIN OR
- HEREWITH IS THE PROPERTY OF ALTIUM LIMITED AND MAY
- BE FREELY DISTRIBUTED IN WHOLE. NO RIGHTS ARE
- RESERVED OR EXPRESS OR IMPLIED WARANTEE GIVEN.
- PROJECT NAME
- TITLE
- AUTHOR
- Rev.
- FILE NAME
- Date
- SHEET
- OF

### Library data of the parts
C9 C12 C14 C17 = CMP-2008-02878-3: as C1 on sheet RAK11720; Case/Package: 0402; Termination: SMD/SMT; Thickness: 0.022inch; Packaging: Tape and Reel; REACH SVHC: No SVHC; Case Code (Imperial): 0402; Width: 0.02inch; Series: -; Construction: Flat; Dielectric: X5R; Voltage: 10V; Height: 0.56mm; Voltage Rating (DC): 10V; Depth: 0.5mm; Tolerance: 10%; Radiation Hardening: No; Voltage Rating: 10V; Package Quantity: 1; Contact Plating: Tin; RoHS Compliant: Yes; Case Code (Metric): 1005; Lead Free: Lead Free; Max Operating Temperature: 85°C; Length: 1mm; Min Operating Temperature: -55°C; Mount: Surface Mount
C10 C13 C15 C18 = CMP-14477-000104-2: as C3 on sheet RAK11720; Packaging: Tape and Reel; Depth: 0.5mm; Mount: Surface Mount; Thickness: 0.022inch; Package Quantity: 1; Min Operating Temperature: -55°C; Series: M; Voltage Rating (DC): 16V; Termination: SMD/SMT; Case/Package: 0402; Number of Pins: 2; Case Code (Imperial): 0402; Length: 1mm; Halogen Free: Halogen Free; Case Code (Metric): 1005; Width: 0.02inch; RoHS Compliant: Yes; Radiation Hardening: No; Max Operating Temperature: 85°C; Height: 0.5mm; Construction: Flat
C11 C16 = CMP-08246-002709-1: Multilayer Ceramic Capacitors 2.2μF ±10% 10V X5R SMD 0402; Packaging: Tape and Reel; REACH SVHC: No SVHC; Case Code (Imperial): 0402; Voltage Rating: 10V; Radiation Hardening: No; Construction: Flat; Case/Package: 0402; Width: 0.02inch; Length: 1mm; Dielectric Material: Ceramic; Series: C; Height: 0.5mm; Depth: 0.5mm; Thickness: 0.022inch; Tolerance: 10%; Package Quantity: 1; Case Code (Metric): 1005; Min Operating Temperature: -55°C; Dielectric: X5R; Number of Pins: 2; Mount: Surface Mount; Resistor Type: Ceramic; RoHS Compliant: Yes; Weight: 2.3E-05oz; Max Operating Temperature: 85°C; Lead Free: Lead Free; Voltage: 10V; Termination: SMD/SMT; Voltage Rating (DC): 10V
J4 = CMP-1502-01062-3: as J1 on sheet RAK11720; REACH SVHC: Unknown; Packaging: Bulk; Contact Material: Copper; Min Operating Temperature: -40°C; Number of Rows: 1; Orientation: Vertical; RoHS: Compliant; Contact Plating: Gold; Max Operating Temperature: 105°C; Mount: Through Hole; Height: 8.94mm; Operating Supply Voltage: 250V; Number of Pins: 3; Contact Mating Length: 5.9944mm; Number of Contacts: 3; Color: Black; Lead Free: Lead Free; Lead Pitch: 2.54mm; Termination: Solder
J7 = CMP-1502-03324-2: NexarPartId: 78871135; Voltage Rating: 300V; Number of Contacts: 2; Current Rating: 16A; Lead Pitch: 5mm; Height: 11.6mm; Packaging: Box; RoHS: Non-Compliant; Contact Material: Nickel, Tin; Max Operating Temperature: 120°C; Number of Pins: 2; Min Operating Temperature: -30°C; Number of Rows: 1
J8 = CMP-1712-00002-6: as J21 on sheet USB_Serial; Height: 8.94mm; Lead Free: Lead Free; Number of Pins: 2; Termination: Through Hole; RoHS: Compliant; Lead Pitch: 2.54mm; REACH SVHC: No SVHC; Housing Material: PBT; Contact Mating Length: 5.9944mm; Min Operating Temperature: -40°C; Orientation: Vertical; Contact Material: Copper; Contact Gender: Male; Max Operating Temperature: 125°C; Number of Rows: 1; Number of Positions: 2; Packaging: Bulk; Contact Plating: Gold; Mount: Through Hole; Color: Black; Operating Supply Voltage: 250V
R3 = CMP-2000-06985-2: 1MΩ ±1% 0.063W 0402 Thick Film Chip Resistor AEC-Q200 compliant; Max Power Dissipation: 63mW; Resistance: 1MR; Power Rating: 62.5mW; Temperature Coefficient: 100ppm/°C; Resistor Type: Thick Film; Military Standard: Not; Packaging: Tape and Reel; Radiation Hardening: No; Construction: Rectangular; Length: 1mm; Case/Package: 0402; Width: 0.02inch; Case Code (Imperial): 0402; Lead Free: Lead Free; Number of Terminations: 2; Min Operating Temperature: -55°C; Height: 0.016inch; Tolerance: 1%; Contact Plating: Tin; Case Code (Metric): 1005; Depth: 0.5mm; Features: Automotive AEC-Q200; Max Operating Temperature: 155°C; Size Code: 0402; Mount: Surface Mount; RoHS Compliant: Yes; Series: RMCF
U3-U6 = STLQ020C33R: No Description Available; Mfr_Name: STMicroelectronics; Copyright: Copyright (C) 2023 Ultra Librarian. All rights reserved.; Manufacturer_Part_Number: STLQ020C33R; RefDes: RefDes; Type: DEV

## Sheet RF.SchDoc
size 420 x 297 mm; ENG_APP_DATE: --/--/--; DSN_APP_DATE: --/--/--; CHK_APP_DATE: --/--/--; Date: TEST; SheetNumber: 5; SheetTotal: 6; Sheet_Text_ProjectName: ApolloEcho_Dev_Kit; Sheet_Text_Author: mtnguyen; Sheet_Text_Title: RF; Sheet_Text_Rev: 2.0.0; Sheet_Text_Date: Mar 01, 25
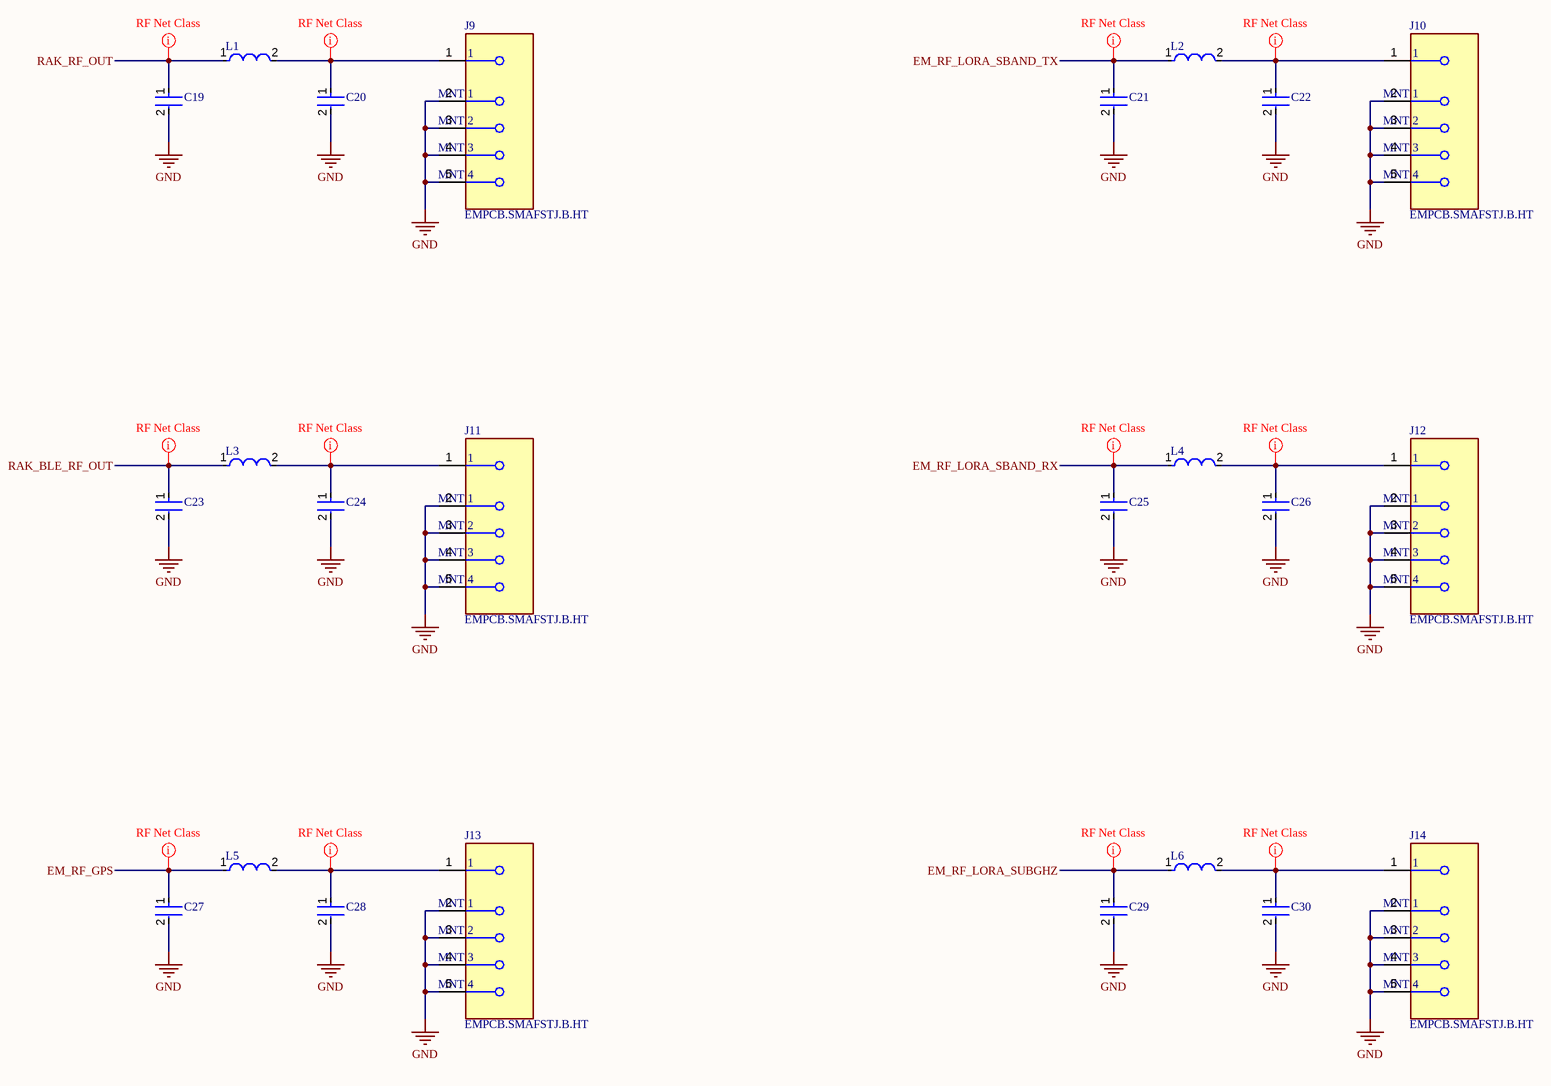
[diagram p4: RF.SchDoc]

### Parts
C19  GJM1555C1H5R0CB01D  [FP-GJM155-0_05-MFG]  (value not drawn)
C20  GJM1555C1H5R0CB01D  [FP-GJM155-0_05-MFG]  (value not drawn)
C21  GJM1555C1H5R0CB01D  [FP-GJM155-0_05-MFG]  (value not drawn)
C22  GJM1555C1H5R0CB01D  [FP-GJM155-0_05-MFG]  (value not drawn)
C23  GJM1555C1H5R0CB01D  [FP-GJM155-0_05-MFG]  (value not drawn)
C24  GJM1555C1H5R0CB01D  [FP-GJM155-0_05-MFG]  (value not drawn)
C25  GJM1555C1H5R0CB01D  [FP-GJM155-0_05-MFG]  (value not drawn)
C26  GJM1555C1H5R0CB01D  [FP-GJM155-0_05-MFG]  (value not drawn)
C27  GJM1555C1H5R0CB01D  [FP-GJM155-0_05-MFG]  (value not drawn)
C28  GJM1555C1H5R0CB01D  [FP-GJM155-0_05-MFG]  (value not drawn)
C29  GJM1555C1H5R0CB01D  [FP-GJM155-0_05-MFG]  (value not drawn)
C30  GJM1555C1H5R0CB01D  [FP-GJM155-0_05-MFG]  (value not drawn)
J9  EMPCB.SMAFSTJ.B.HT  [FP-EMPCB_SMAFSTJ_B_HT-MFG]
J10  EMPCB.SMAFSTJ.B.HT  [FP-EMPCB_SMAFSTJ_B_HT-MFG]
J11  EMPCB.SMAFSTJ.B.HT  [FP-EMPCB_SMAFSTJ_B_HT-MFG]
J12  EMPCB.SMAFSTJ.B.HT  [FP-EMPCB_SMAFSTJ_B_HT-MFG]
J13  EMPCB.SMAFSTJ.B.HT  [FP-EMPCB_SMAFSTJ_B_HT-MFG]
J14  EMPCB.SMAFSTJ.B.HT  [FP-EMPCB_SMAFSTJ_B_HT-MFG]
L1  LQW15AN2N9D00D  [FP-LQW15AN_00-W0_6-0_1-MFG]  (value not drawn)
L2  LQW15AN2N9D00D  [FP-LQW15AN_00-W0_6-0_1-MFG]  (value not drawn)
L3  LQW15AN2N9D00D  [FP-LQW15AN_00-W0_6-0_1-MFG]  (value not drawn)
L4  LQW15AN2N9D00D  [FP-LQW15AN_00-W0_6-0_1-MFG]  (value not drawn)
L5  LQW15AN2N9D00D  [FP-LQW15AN_00-W0_6-0_1-MFG]  (value not drawn)
L6  LQW15AN2N9D00D  [FP-LQW15AN_00-W0_6-0_1-MFG]  (value not drawn)

### Nets
GND: C19.2 C20.2 C21.2 C22.2 C23.2 C24.2 C25.2 C26.2 C27.2 C28.2 C29.2 C30.2 J9.2(MNT_1) J9.3(MNT_2) J9.4(MNT_3) J9.5(MNT_4) J10.2(MNT_1) J10.3(MNT_2) J10.4(MNT_3) J10.5(MNT_4) J11.2(MNT_1) J11.3(MNT_2) J11.4(MNT_3) J11.5(MNT_4) J12.2(MNT_1) J12.3(MNT_2) J12.4(MNT_3) J12.5(MNT_4) J13.2(MNT_1) J13.3(MNT_2) J13.4(MNT_3) J13.5(MNT_4) J14.2(MNT_1) J14.3(MNT_2) J14.4(MNT_3) J14.5(MNT_4)
EM_RF_GPS: C27.1 L5.1
EM_RF_LORA_SBAND_RX: C25.1 L4.1
EM_RF_LORA_SBAND_TX: C21.1 L2.1
EM_RF_LORA_SUBGHZ: C29.1 L6.1
RAK_BLE_RF_OUT: C23.1 L3.1
RAK_RF_OUT: C19.1 L1.1
NetC20_1: C20.1 J9.1 L1.2
NetC22_1: C22.1 J10.1 L2.2
NetC24_1: C24.1 J11.1 L3.2
NetC26_1: C26.1 J12.1 L4.2
NetC28_1: C28.1 J13.1 L5.2
NetC30_1: C30.1 J14.1 L6.2

### Layout directives
net class RF_Nets: EM_RF_GPS, EM_RF_LORA_SBAND_RX, EM_RF_LORA_SBAND_TX, EM_RF_LORA_SUBGHZ, NetC20_1, NetC22_1, NetC24_1, NetC26_1, NetC28_1, NetC30_1, RAK_BLE_RF_OUT, RAK_RF_OUT

### Notes on the sheet
- THIS DOCUMENT AND THE DATA DISCLOSED HEREIN OR
- HEREWITH IS THE PROPERTY OF ALTIUM LIMITED AND MAY
- BE FREELY DISTRIBUTED IN WHOLE. NO RIGHTS ARE
- RESERVED OR EXPRESS OR IMPLIED WARANTEE GIVEN.
- PROJECT NAME
- TITLE
- AUTHOR
- Rev.
- FILE NAME
- Date
- SHEET
- OF

### Library data of the parts
C19-C30 = CMP-2008-03860-2: Multi-Layer Ceramic Capacitor 5pF C0G  ±0.25pF 0402 Paper T/R; Voltage Rating: 50V; Length: 1mm; Case Code (Metric): 1005; Thickness: 0.022inch; Height: 0.5mm; Capacitance: 5pF; Mount: Surface Mount; Case Code (Imperial): 0402; Package Quantity: 1; Termination: SMD/SMT; Radiation Hardening: No; Lead Free: Lead Free; Max Operating Temperature: 125°C; Dielectric: C0G; Case/Package: 0402; Depth: 0.5mm; Width: 0.02inch; Packaging: Tape and Reel; Min Operating Temperature: -55°C; Voltage Rating (DC): 50V
J9-J14 = CMP-111093-000001-1: CONN SMA JACK STR 50OHM EDGE MNT; Manufacturer: Taoglas Limited; Conn Orientation: Horizontal; Frequency: 12.4GHz; Impedance: 50Ω; Voltage Rating: 335V; Is Female: yes; Pitch: 2.62mm; Number Of Contacts: 1; Device Class L2: RF / Coaxial Connectors; Category: Conn; Contact Material: Gold; Device Class L1: Connectors; Digikey Description: CONN SMA JACK STR 50OHM EDGE MNT; Temperature Range Low: -40°C; Octopart: https://octopart.com/empcb.smafstj.b.ht-taoglas-24204431; ComponentLink2URL: https://cdn.taoglas.com/datasheets/EMPCB.SMAFSTJ.B.HT.pdf; Temperature Range High: +85°C; Device Class L3: unset; Temperature: -40°C to +85°C; Package: 0; RoHS: TRUE; Lead Free: Yes; Automotive: No; ComponentLink2Description: Datasheet; Mouser Description: RF Connectors / Coaxial Connectors SMA Straight Edge Mount PCB Jack-Gold; Manufacturer Part Number: EMPCB.SMAFSTJ.B.HT
L1-L6 = CMP-06042-011289-1: Wire Wound RF Inductor 2.9nH ±0.5nH 750mA 0.07Ω 0402 (1005); DC Resistance (DCR): 70mR; Core Material: Non-Magnetic; Shielding: Unshielded; Self Resonant Frequency: 15GHz; Test Frequency: 100MHz; Q Factor: 20; Radiation Hardening: No; DC Current: 750mA; Resistor Type: Wirewound; Case Code (Metric): 1005; Max Operating Temperature: 125°C; Height - Seated (Max): 0.024inch; Case Code (Imperial): 0402; Max DC Current: 750mA; Packaging: Tape and Reel; Width: 0.02inch; Height: 0.5mm; Mount: Surface Mount; Depth: 0.7mm; Weight: 2.8E-05oz; Inductance: 2.9nH; Termination: SMD/SMT; Length: 1mm; Min Operating Temperature: -55°C; Current Rating: 750mA; Military Standard: Not; Package Quantity: 1; Case/Package: 0402

## Sheet IOs.SchDoc
size 420 x 297 mm; ENG_APP_DATE: --/--/--; DSN_APP_DATE: --/--/--; CHK_APP_DATE: --/--/--; Date: TEST; SheetNumber: 6; SheetTotal: 6; Sheet_Text_ProjectName: ApolloEcho_Dev_Kit; Sheet_Text_Author: mtnguyen; Sheet_Text_Title: IOs; Sheet_Text_Rev: 2.0.0; Sheet_Text_Date: Mar 01, 25
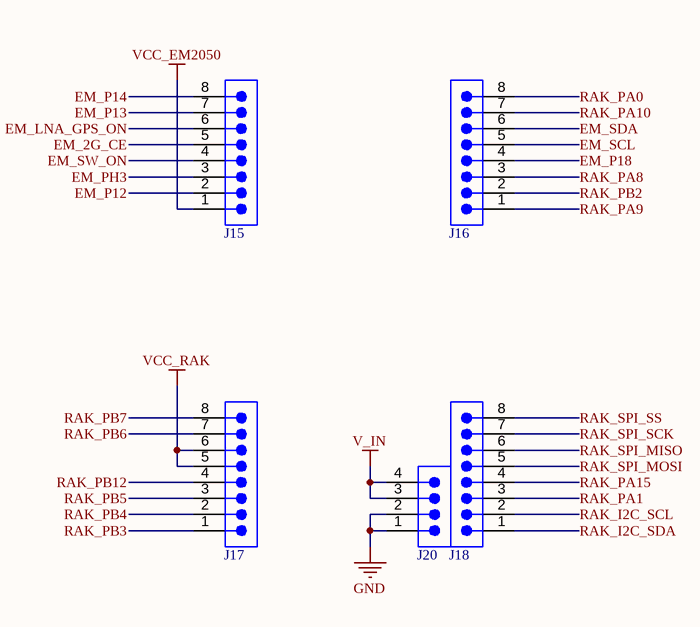
[diagram p5: IOs.SchDoc]

### Parts
J15  61300811121  [61300811121]  (value not drawn)
J16  61300811121  [61300811121]  (value not drawn)
J17  61300811121  [61300811121]  (value not drawn)
J18  61300811121  [61300811121]  (value not drawn)
J20  61300411121  [61300411121]  (value not drawn)

### Nets
GND: J20.1 J20.2
V_IN: J20.3 J20.4
VCC_EM2050: J15.1
VCC_RAK: J17.5 J17.6
EM_2G_CE: J15.5
EM_LNA_GPS_ON: J15.6
EM_P12: J15.2
EM_P13: J15.7
EM_P14: J15.8
EM_P18: J16.4
EM_PH3: J15.3
EM_SCL: J16.5
EM_SDA: J16.6
EM_SW_ON: J15.4
RAK_I2C_SCL: J18.2
RAK_I2C_SDA: J18.1
RAK_PA0: J16.8  [project net EM_CTS]
RAK_PA1: J18.3  [project net LED_USER_2_R]
RAK_PA8: J16.3  [project net EM_PWR_EN]
RAK_PA9: J16.1  [project net BTN_USER_1]
RAK_PA10: J16.7  [project net EM_RTS]
RAK_PA15: J18.4  [project net LED_USER_1_G]
RAK_PB2: J16.2  [project net BTN_USER_2]
RAK_PB3: J17.1
RAK_PB4: J17.2
RAK_PB5: J17.3  [project net EM_NRST]
RAK_PB6: J17.7
RAK_PB7: J17.8
RAK_PB12: J17.4
RAK_SPI_MISO: J18.6  [project net RAK_PA6]
RAK_SPI_MOSI: J18.5  [project net RAK_PA7]
RAK_SPI_SCK: J18.7  [project net RAK_PA5]
RAK_SPI_SS: J18.8  [project net RAK_PA4]

### Notes on the sheet
- THIS DOCUMENT AND THE DATA DISCLOSED HEREIN OR
- HEREWITH IS THE PROPERTY OF ALTIUM LIMITED AND MAY
- BE FREELY DISTRIBUTED IN WHOLE. NO RIGHTS ARE
- RESERVED OR EXPRESS OR IMPLIED WARANTEE GIVEN.
- PROJECT NAME
- TITLE
- AUTHOR
- Rev.
- FILE NAME
- Date
- SHEET
- OF

### Library data of the parts
J15-J18 = CMP-1502-01076-3: NexarPartId: 32855533; Connector Type: Male Pin; Number of Contacts: 8; Voltage Rating: 250V; Current Rating: 3A; Contact Resistance: 20mΩ; Pitch: 2.54mm; Gender: Male; Termination: Solder; Contact Material: Copper; Mount: Through Hole; Lead Pitch: 2.54mm; Number of Positions: 8; Operating Supply Voltage: 250V; Number of Pins: 8; Max Operating Temperature: 105°C; Height: 8.54mm; REACH SVHC: Unknown; Number of Rows: 1; Packaging: Bulk; Contact Plating: Gold; Contact Mating Length: 5.9944mm; Orientation: Vertical; RoHS: Compliant; Color: Black; Min Operating Temperature: -40°C
J20 = CMP-1502-01064-3: as J3 on sheet USB_Serial; Contact Plating: Gold; Height: 8.89mm; Lead Pitch: 2.54mm; Lead Free: Lead Free; Contact Mating Length: 5.9944mm; Number of Rows: 1; Termination: Solder; Packaging: Bulk; REACH SVHC: Unknown; Min Operating Temperature: -40°C; RoHS: Compliant; Number of Contacts: 4; Voltage Rating: 250V; Color: Black; Max Operating Temperature: 105°C; Contact Material: Copper; Mount: Through Hole; Orientation: Vertical; Number of Pins: 4

## Nets that join several sheets
GND: RAK11720 (19 pins), EM2050 (26 pins), USB_Serial (9 pins), Power (17 pins), RF (36 pins), IOs (J20.1 J20.2)
V_IN: USB_Serial (J6.1 J23.1), Power (14 pins), IOs (J20.3 J20.4)
VCC_EM2050: EM2050 (8 pins), Power (5 pins), IOs (J15.1)
VCC_RAK: RAK11720 (7 pins), Power (C12.1 C13.1 U3.5), IOs (J17.5 J17.6)
BTN_USER_1: RAK11720 (SW_U1.A1 SW_U1.A2 U1.20), IOs (J16.1)
BTN_USER_2: RAK11720 (SW_U2.A1 SW_U2.A2 U1.26), IOs (J16.2)
EM_2G_CE: EM2050 (U2.P4), IOs (J15.5)
EM_CTS: RAK11720 (U1.29), EM2050 (U2.P19), IOs (J16.8)
EM_LNA_GPS_ON: EM2050 (U2.P6), IOs (J15.6)
EM_NRST: RAK11720 (U1.30), EM2050 (U2.P10), IOs (J17.3)
EM_P12: EM2050 (U2.P12), IOs (J15.2)
EM_P13: EM2050 (U2.P13), IOs (J15.7)
EM_P14: EM2050 (U2.P14), IOs (J15.8)
EM_P18: EM2050 (U2.P18), IOs (J16.4)
EM_PH3: EM2050 (U2.P11), IOs (J15.3)
EM_PWR_EN: RAK11720 (U1.19), Power (J4.1), IOs (J16.3)
EM_RF_GPS: EM2050 (U2.P38), RF (C27.1 L5.1)
EM_RF_LORA_SBAND_RX: EM2050 (U2.P41), RF (C25.1 L4.1)
EM_RF_LORA_SBAND_TX: EM2050 (U2.P35), RF (C21.1 L2.1)
EM_RF_LORA_SUBGHZ: EM2050 (U2.P44), RF (C29.1 L6.1)
EM_RTS: RAK11720 (U1.25), EM2050 (U2.P20), IOs (J16.7)
EM_SCL: EM2050 (U2.P24), IOs (J16.5)
EM_SDA: EM2050 (U2.P23), IOs (J16.6)
EM_SW_ON: EM2050 (U2.P7), IOs (J15.4)
EM_UART_RXD: EM2050 (U2.P1), USB_Serial (J19.3)
EM_UART_TXD: EM2050 (U2.P3), USB_Serial (J3.3)
LED_USER_1_G: RAK11720 (D1.2 U1.3), IOs (J18.4)
LED_USER_2_R: RAK11720 (D2.2 U1.6), IOs (J18.3)
RAK_BLE_RF_OUT: RAK11720 (U1.33), RF (C23.1 L3.1)
RAK_I2C_SCL: RAK11720 (U1.9), IOs (J18.2)
RAK_I2C_SDA: RAK11720 (U1.10), IOs (J18.1)
RAK_PA2: RAK11720 (U1.2), USB_Serial (J19.4)
RAK_PA3: RAK11720 (U1.1), USB_Serial (J3.4)
RAK_PA4: RAK11720 (U1.16), IOs (J18.8)
RAK_PA5: RAK11720 (U1.15), IOs (J18.7)
RAK_PA6: RAK11720 (U1.14), IOs (J18.6)
RAK_PA7: RAK11720 (U1.13), IOs (J18.5)
RAK_PB3: RAK11720 (U1.32), IOs (J17.1)
RAK_PB4: RAK11720 (U1.31), IOs (J17.2)
RAK_PB6: RAK11720 (U1.4), USB_Serial (J3.1), IOs (J17.7)
RAK_PB7: RAK11720 (U1.5), USB_Serial (J19.1), IOs (J17.8)
RAK_PB12: RAK11720 (U1.27), IOs (J17.4)
RAK_RF_OUT: RAK11720 (U1.12), RF (C19.1 L1.1)